# EAGLE design mintyboostv3_SingleSidedDIY (EAGLE 6.4)
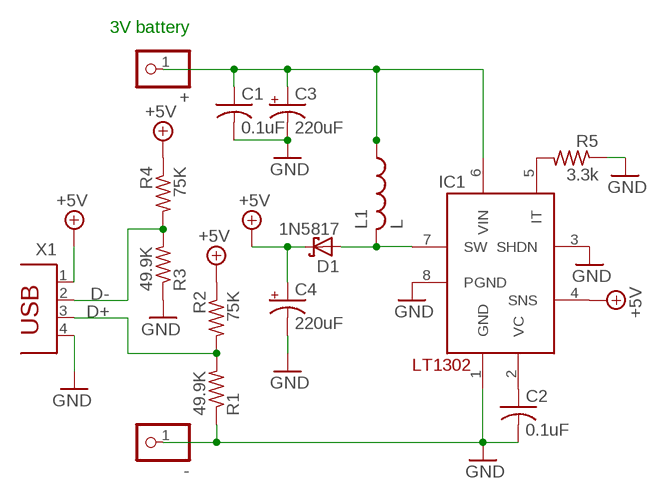
[diagram p0: schematic, sheet 1]

## Parts
+  PINHD-1X1  [1X01]
-  PINHD-1X1  [1X01]
C1  0.1uF  C-US025-025X050  [C025-025X050]
C2  0.1uF  C-US025-025X050  [C025-025X050]
C3  220uF  CPOL-USE2.5-5  [E2,5-5]
C4  220uF  CPOL-USE2.5-5  [E2,5-5]
D1  1N5817  SCHOTTKY-DIODEDO41-7  [DO41-7]
IC1  LT1302  [DIL08]
L1  L  [6000]
R1  49.9K  R-US_0204/5  [0204/5]
R2  75K  R-US_0204/5  [0204/5]
R3  49.9K  R-US_0204/5  [0204/5]
R4  75K  R-US_0204/5  [0204/5]
R5  3.3k  R-US_0204/5  [0204/5]
X1  PN87520  [PN87520]

## Nets
+5V: C4.+ D1.C IC1.4(SNS) R2.1 R4.1 X1.1
BATT+: +.1 C1.1 C3.+ IC1.6(VIN) L1.1
D+: R1.2 R2.2 X1.3
D-: R3.2 R4.2 X1.2
GND: -.1 C1.2 C2.2 C3.- C4.- IC1.1(GND) IC1.3(SHDN) IC1.8(PGND) R1.1 R3.1 R5.1 X1.4
N$1: C2.1 IC1.2(VC)
N$2: IC1.5(IT) R5.2
N$5: D1.A IC1.7(SW) L1.2

## Notes on the sheet
- 3V battery

## Library data of the parts
+ - = pinhead-ez:PINHD-1X1: PIN HEADER
C1 C2 = adafruit:C-US: CAPACITOR, American symbol
C3 C4 = adafruit:CPOL-US: POLARIZED CAPACITOR, American symbol
D1 = adafruit:SCHOTTKY-DIODE: Schottky Diode
IC1 = adafruit:LT1302
L1 = adafruit:L
R1-R5 = adafruit:R-US_: RESISTOR, American symbol
X1 = con-berg:PN87520: BERG USB connector

## Board
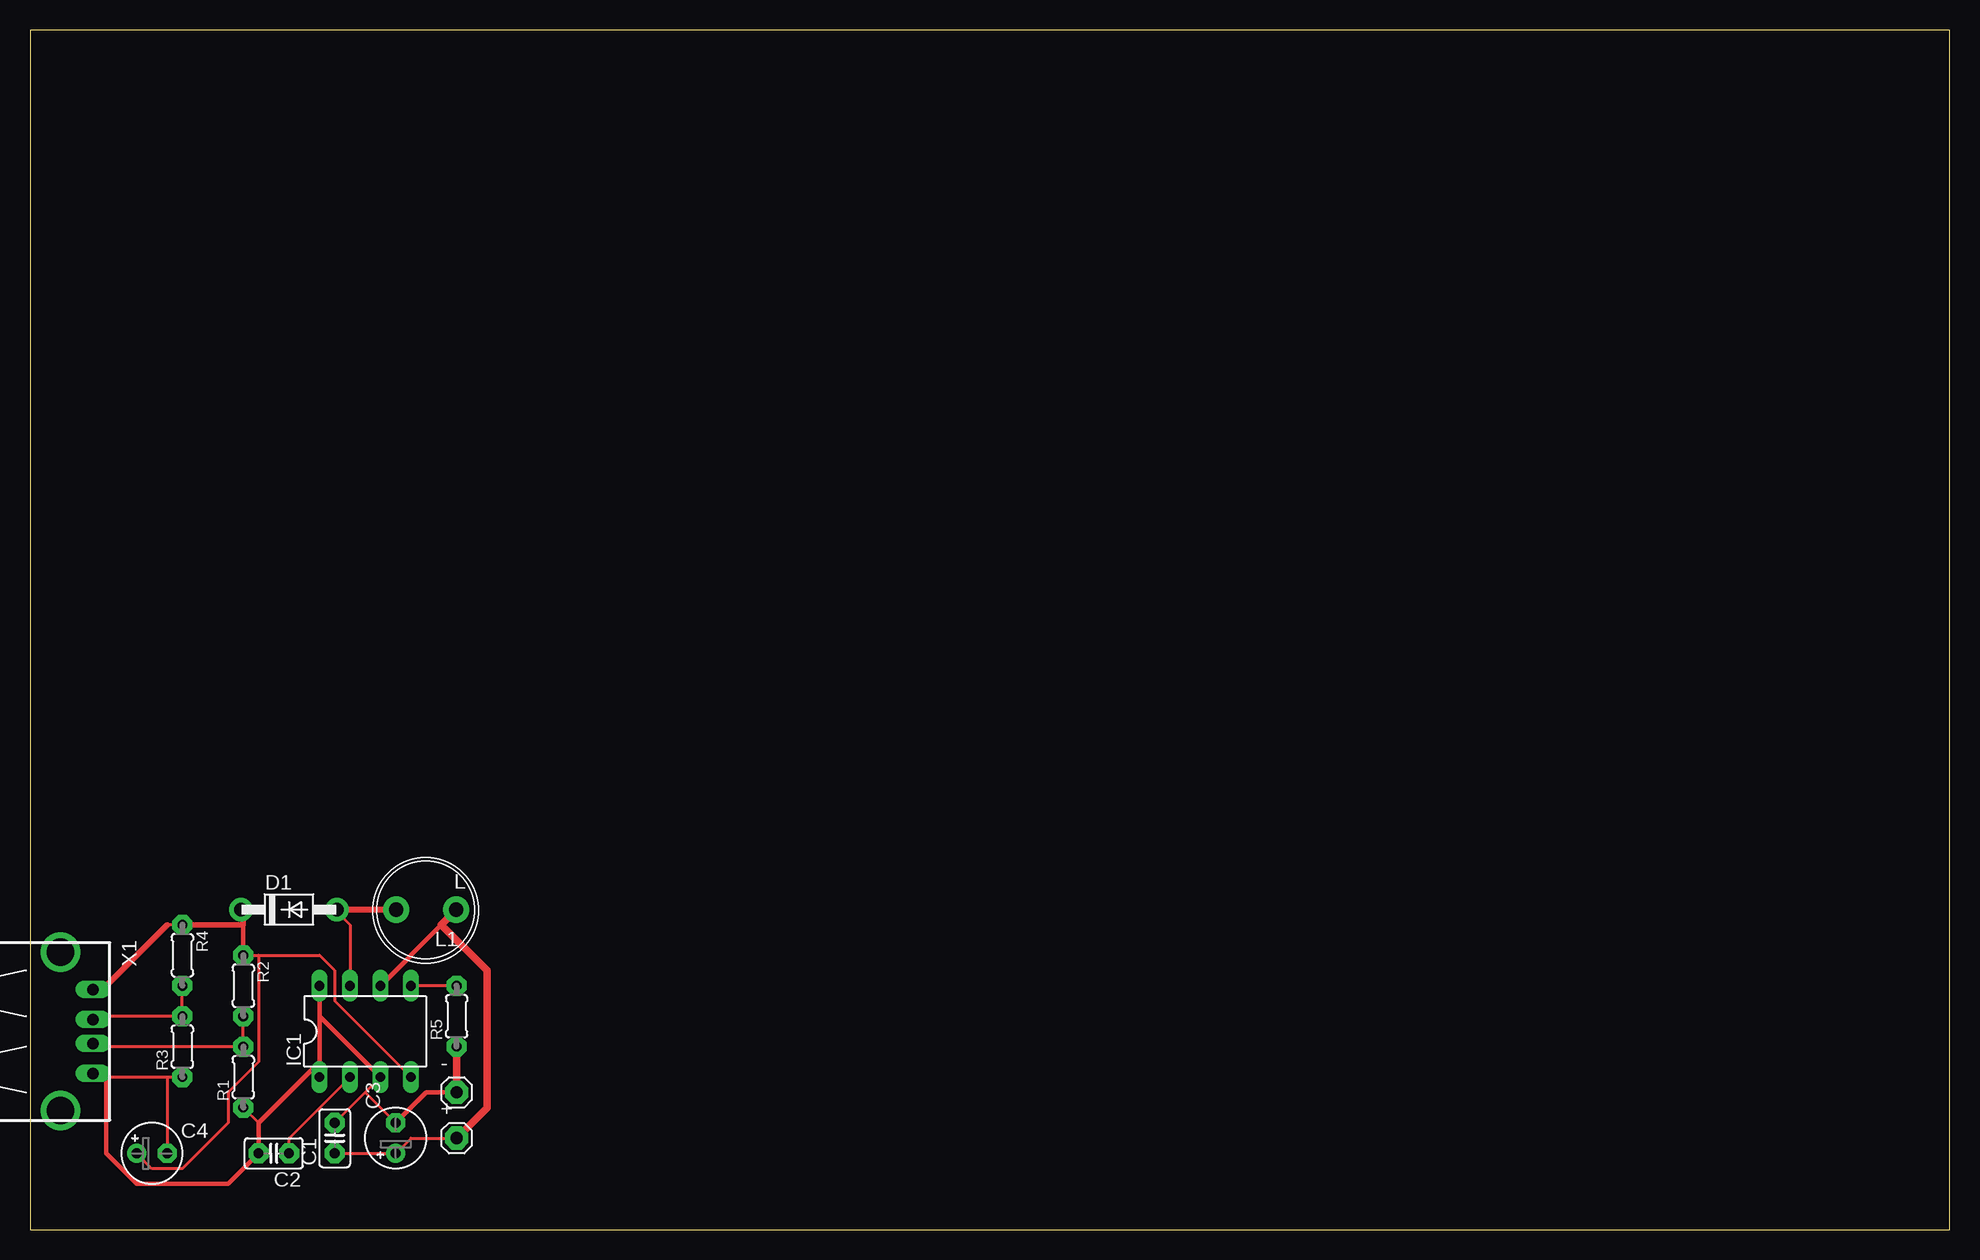
[diagram p1: board, top side]

Size 160 x 100 mm. Coordinates in mm from the lower left corner, seen from the top.
Outline: 0,0 160,0 160,100 0,100 0,0
Copper layers (1*16): Top 0.035mm / dielectric 1.5mm / Bottom 0.035mm
Design rules "default": minimum track width 10mil, minimum drill 24mil, track to track 8mil, track to pad 8mil, pad to pad 8mil, via to via 8mil, smd to smd 8mil, copper to edge 40mil, drill to drill 8mil, minimum pad ring 10mil, minimum via ring 8mil, stop-mask expansion 4mil, vias tented up to drill 0mil, thermal gap 10mil

### Footprints (pad centres in the part's own frame; a part is rotated, then mirrored left to right if it is on the bottom)
1X01 = drill 1.016 pad 1.93 octagon: 1 0,0
C025-025X050 = drill 0.813 pad 1.676 octagon: 1 -1.27,0; 2 1.27,0
E2,5-5 = drill 0.813 pad 1.6: + -1.27,0 | drill 0.813 pad 1.6 octagon: - 1.27,0
DO41-7 = drill 1.118 pad 1.93: A 4,0; C -4,0
DIL08 = drill 0.813 long: 1 -3.81,-3.81; 2 -1.27,-3.81; 3 1.27,-3.81; 4 3.81,-3.81; 5 3.81,3.81; 6 1.27,3.81; 7 -1.27,3.81; 8 -3.81,3.81
6000 = drill 1.2 pad 2.184: 1 -2.5,0; 2 2.5,0
0204/5 = drill 0.813 pad 1.676 octagon: 1 -2.54,0; 2 2.54,0
PN87520 = drill 0.95 long: 1 -3.5,2.71; 2 -1,2.71; 3 1,2.71; 4 3.5,2.71 | drill 2.286: P$1 -6.604,0; P$2 6.604,0

### Placement (x,y rotation side)
+  35.56,7.62 0 top
-  35.56,11.43 0 top
C1  25.4,7.62 90 top
C2  20.32,6.35 180 top
C3  30.48,7.62 90 top
C4  10.16,6.35 0 top
D1  21.59,26.67 0 top
IC1  27.94,16.51 0 top
L1  33.02,26.67 180 top
R1  17.78,12.7 90 top
R2  17.78,20.32 270 top
R3  12.7,15.24 90 top
R4  12.7,22.86 270 top
R5  35.56,17.78 90 top
X1  2.54,16.51 270 top

### Tracks (layer width: path | path; a pad name or v marks a point on that pad's centre or on a via)
+5V
  Top 0.254: R4.1 11.43,25.4 | 6.35,20.32 X1.1 | IC1.4 25.4,19.05 25.4,21.59 24.13,22.86 19.05,22.86 | R2.1 19.05,22.86 | C4.+ 10.16,5.08 12.7,5.08 16.51,8.89 16.51,11.43 19.05,13.97 19.05,22.86 | 17.78,26.67 D1.C
  Top 0.381: R2.1 17.78,25.4
  Top 0.445: 11.43,25.4 6.35,20.32 | 17.78,26.67 17.78,25.4 R4.1
BATT+
  Top 0.254: C1.1 C3.+ 31.75,7.62 +.1 | 35.56,26.67 L1.1
  Top 0.381: 34.29,25.4 IC1.6
  Top 0.635: 35.56,26.67 34.29,25.4 38.1,21.59 38.1,10.16 +.1
D+
  Top 0.254: X1.3 6.35,15.24 R1.2 R2.2
D-
  Top 0.254: X1.2 6.35,17.78 R3.2 R4.2
GND
  Top 0.254: C1.2 27.94,11.43 | 27.94,11.43 IC1.3 | 27.94,11.43 C3.- | R3.1 11.43,12.7 | 11.43,12.7 6.35,12.7 X1.4 | 11.43,12.7 C4.- | R1.1 19.05,8.89 | 24.13,13.97 IC1.1
  Top 0.381: -.1 33.02,11.43 C3.- | IC1.8 24.13,17.78 | 24.13,17.78 24.13,13.97 19.05,8.89 C2.2 16.51,3.81 8.89,3.81 6.35,6.35 6.35,12.7 | 24.13,17.78 IC1.3
  Top 0.635: -.1 R5.1
N$1
  Top 0.254: IC1.2 21.59,7.62 C2.1
N$2
  Top 0.254: R5.2 IC1.5
N$5
  Top 0.254: IC1.7 26.67,25.4 25.4,26.67 D1.A
  Top 0.508: D1.A L1.2